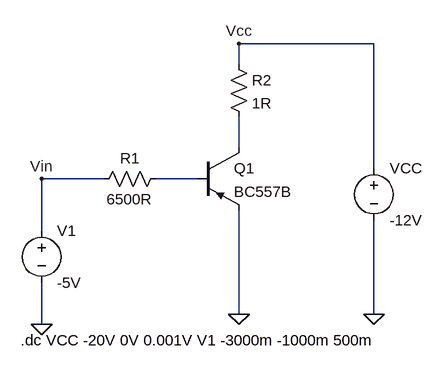
[diagram p0: schematic BC560B_Ausgangskennlinie.asc]
BC560B_Ausgangskennlinie.asc, the LTspice schematic file:
Version 4
SHEET 1 880 680
WIRE 416 -96 208 -96
WIRE 208 -64 208 -96
WIRE 208 64 208 16
WIRE 416 96 416 -96
WIRE 0 112 -96 112
WIRE 144 112 80 112
WIRE -96 192 -96 112
WIRE 208 320 208 160
WIRE 416 320 416 176
WIRE -96 336 -96 272
FLAG 208 320 0
FLAG 416 320 0
FLAG -96 336 0
FLAG -96 112 Vin
FLAG 208 -96 Vcc
SYMBOL voltage 416 80 R0
SYMATTR InstName VCC
SYMATTR Value -12V
SYMBOL res 192 -80 R0
SYMATTR InstName R2
SYMATTR Value 1R
SYMBOL voltage -96 176 R0
WINDOW 123 0 0 Left 0
WINDOW 39 0 0 Left 0
SYMATTR InstName V1
SYMATTR Value -5V
SYMBOL res -16 128 R270
WINDOW 0 32 56 VTop 2
WINDOW 3 0 56 VBottom 2
SYMATTR InstName R1
SYMATTR Value 6500R
SYMBOL pnp 144 64 R0
SYMATTR InstName Q1
SYMATTR Value BC557B
TEXT -128 360 Left 2 !.dc VCC -20V 0V 0.001V V1 -3000m -1000m 500m

The netlist it stands for:
* BC560B_Ausgangskennlinie.asc
VCC Vcc 0 -12V
R2 Vcc N001 1R
V1 Vin 0 -5V
R1 Vin N002 6500R
Q1 N001 N002 0 0 BC557B
.model NPN NPN
.model PNP PNP
.lib standard.bjt
.dc VCC -20V 0V 0.001V V1 -3000m -1000m 500m
.backanno
.end